# EAGLE design Pure Keys aec-pcb3-inProgress (EAGLE 8.7.0)

## Sheet 1 of 7: ATMEGA328P
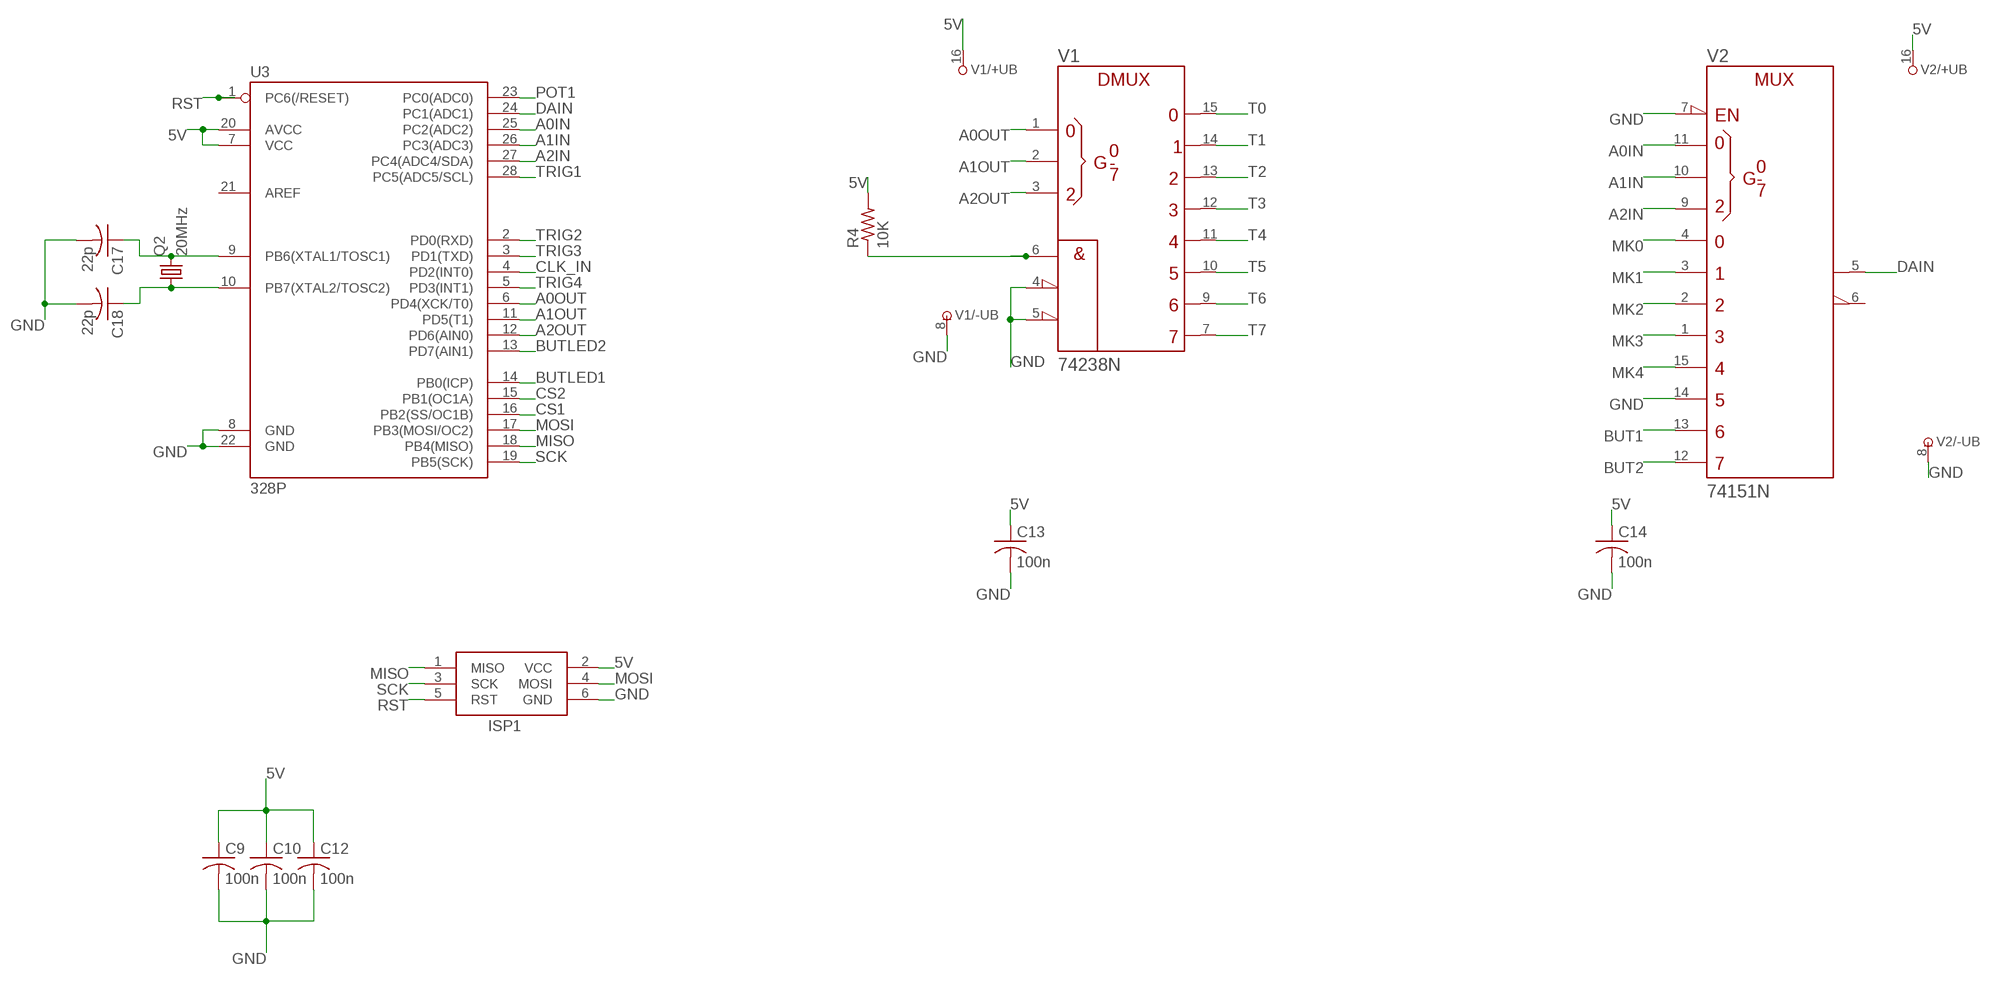
[diagram p0: schematic, sheet 1]

### Parts
C9  100n  C-USC0805K  [C0805K]
C10  100n  C-USC0805K  [C0805K]
C12  100n  C-USC0805K  [C0805K]
C13  100n  C-USC0805K  [C0805K]
C14  100n  C-USC0805K  [C0805K]
C17  22p  C-USC0805K  [C0805K]
C18  22p  C-USC0805K  [C0805K]
ISP1  AVRISP-6  [AVRISP]
Q2  20MHz  CRYSTALHC49UP  [HC49UP]
R4  10K  R-US_R0805  [R0805]
U3  328P  ATMEGA328P_PDIP  [DIP28]
V1  74238N  [DIL16]
V2  74151N  [DIL16]

### Nets
5V [Power]: C9.1 C10.1 C12.1 C13.1 C14.1 ISP1.2(VCC) R4.2 U3.7(VCC) U3.20(AVCC) V1.16(+UB) V2.16(+UB) ; also sheet 2,4,5,6,7
A0IN: U3.25(PC2(ADC2)) V2.11(A)
A0OUT: U3.6(PD4(XCK/T0)) V1.1(A)
A1IN: U3.26(PC3(ADC3)) V2.10(B)
A1OUT: U3.11(PD5(T1)) V1.2(B)
A2IN: U3.27(PC4(ADC4/SDA)) V2.9(C)
A2OUT: U3.12(PD6(AIN0)) V1.3(C)
BUT1: V2.13(D6) ; also sheet 6
BUT2: V2.12(D7) ; also sheet 6
BUTLED1: U3.14(PB0(ICP)) ; also sheet 6
BUTLED2: U3.13(PD7(AIN1)) ; also sheet 6
CLK_IN: U3.4(PD2(INT0)) ; also sheet 7
CS1: U3.16(PB2(SS/OC1B)) ; also sheet 5
CS2: U3.15(PB1(OC1A)) ; also sheet 5
DAIN: U3.24(PC1(ADC1)) V2.5(Y)
ENOUT: R4.1 V1.6(G1)
GND [Power]: C9.2 C10.2 C12.2 C13.2 C14.2 C17.2 C18.2 ISP1.6(GND) U3.8(GND) U3.22(GND) V1.4(!G2A) V1.5(!G2B) V1.8(-UB) V2.7(!G) V2.8(-UB) V2.14(D5) ; also sheet 2,3,4,5,6,7
MISO: ISP1.1(MISO) U3.18(PB4(MISO))
MK0: V2.4(D0) ; also sheet 3
MK1: V2.3(D1) ; also sheet 3
MK2: V2.2(D2) ; also sheet 3
MK3: V2.1(D3) ; also sheet 3
MK4: V2.15(D4) ; also sheet 3
MOSI: ISP1.4(MOSI) U3.17(PB3(MOSI/OC2)) ; also sheet 5
N$10: C17.1 Q2.2 U3.9(PB6(XTAL1/TOSC1))
N$11: C18.1 Q2.1 U3.10(PB7(XTAL2/TOSC2))
POT1: U3.23(PC0(ADC0)) ; also sheet 6
RST: ISP1.5(RST) U3.1(PC6(/RESET))
SCK: ISP1.3(SCK) U3.19(PB5(SCK)) ; also sheet 5
T0: V1.15(Y0) ; also sheet 3
T1: V1.14(Y1) ; also sheet 3
T2: V1.13(Y2) ; also sheet 3
T3: V1.12(Y3) ; also sheet 3
T4: V1.11(Y4) ; also sheet 3
T5: V1.10(Y5) ; also sheet 3
T6: V1.9(Y6) ; also sheet 3
T7: V1.7(Y7) ; also sheet 3
TRIG1: U3.28(PC5(ADC5/SCL)) ; also sheet 4
TRIG2: U3.2(PD0(RXD)) ; also sheet 4
TRIG3: U3.3(PD1(TXD)) ; also sheet 4
TRIG4: U3.5(PD3(INT1)) ; also sheet 4
Unconnected: U3.21(AREF) V2.6(W)

## Sheet 2 of 7: Power
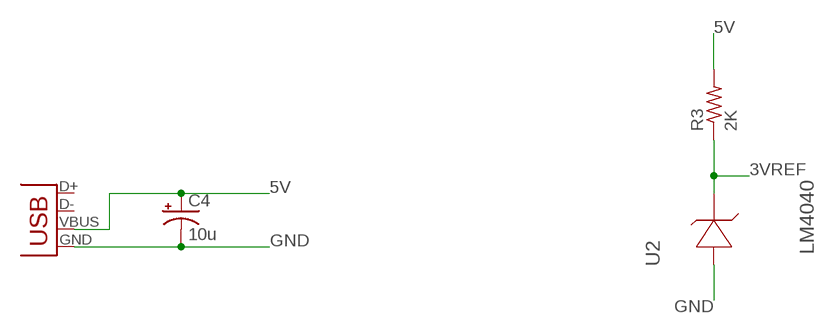
[diagram p1: schematic, sheet 2]

### Parts
C4  10u  CPOL-US153CLV-0505  [153CLV-0505]
JP2  USB-B  USBPTH  [USB-B-PTH]
R3  2K  R-US_R0805  [R0805]
U2  LM4040  LM4040A30IDBZT  [SOT95P237X112-3N]

### Nets
3VREF: R3.1 U2.1(CATHODE) ; also sheet 5
5V [Power]: C4.+ JP2.VBUS R3.2 ; also sheet 1,4,5,6,7
GND [Power]: C4.- JP2.GND U2.2(ANODE) ; also sheet 1,3,4,5,6,7
Unconnected: JP2.D+ JP2.D- U2.3(NC)

## Sheet 3 of 7: Keyboard Connector
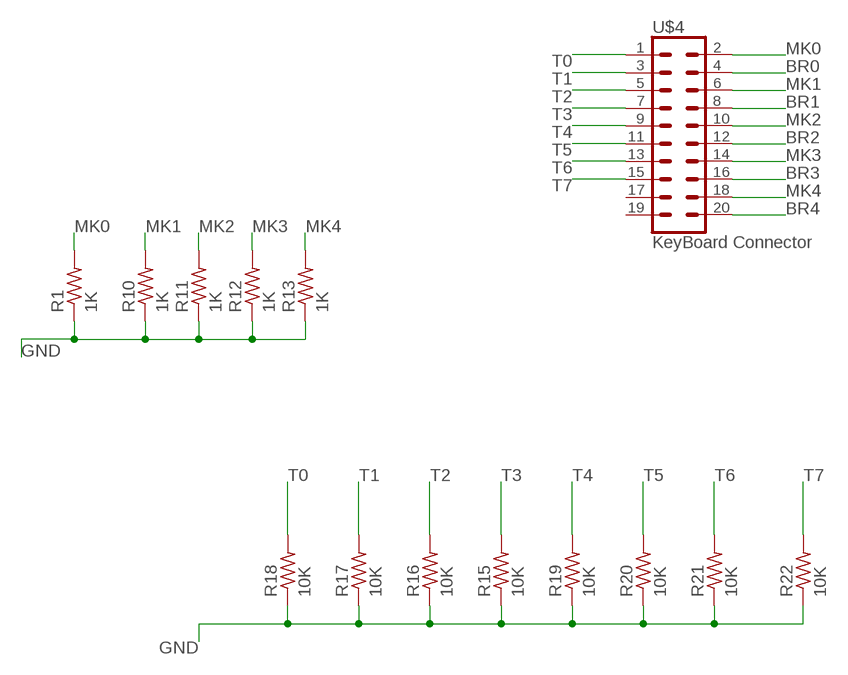
[diagram p2: schematic, sheet 3]

### Parts
R1  1K  R-US_R0805  [R0805]
R10  1K  R-US_R0805  [R0805]
R11  1K  R-US_R0805  [R0805]
R12  1K  R-US_R0805  [R0805]
R13  1K  R-US_R0805  [R0805]
R15  10K  R-US_R0805  [R0805]
R16  10K  R-US_R0805  [R0805]
R17  10K  R-US_R0805  [R0805]
R18  10K  R-US_R0805  [R0805]
R19  10K  R-US_R0805  [R0805]
R20  10K  R-US_R0805  [R0805]
R21  10K  R-US_R0805  [R0805]
R22  10K  R-US_R0805  [R0805]
U$4  KeyBoard Connector  CONN_10X2  [2X10]

### Nets
BR0: U$4.4
BR1: U$4.8
BR2: U$4.12
BR3: U$4.16
BR4: U$4.20
GND [Power]: R1.1 R10.1 R11.1 R12.1 R13.1 R15.1 R16.1 R17.1 R18.1 R19.1 R20.1 R21.1 R22.1 ; also sheet 1,2,4,5,6,7
MK0: R1.2 U$4.2 ; also sheet 1
MK1: R10.2 U$4.6 ; also sheet 1
MK2: R11.2 U$4.10 ; also sheet 1
MK3: R12.2 U$4.14 ; also sheet 1
MK4: R13.2 U$4.18 ; also sheet 1
T0: R18.2 U$4.1 ; also sheet 1
T1: R17.2 U$4.3 ; also sheet 1
T2: R16.2 U$4.5 ; also sheet 1
T3: R15.2 U$4.7 ; also sheet 1
T4: R19.2 U$4.9 ; also sheet 1
T5: R20.2 U$4.11 ; also sheet 1
T6: R21.2 U$4.13 ; also sheet 1
T7: R22.2 U$4.15 ; also sheet 1
Unconnected: U$4.17 U$4.19

## Sheet 4 of 7: Triggers
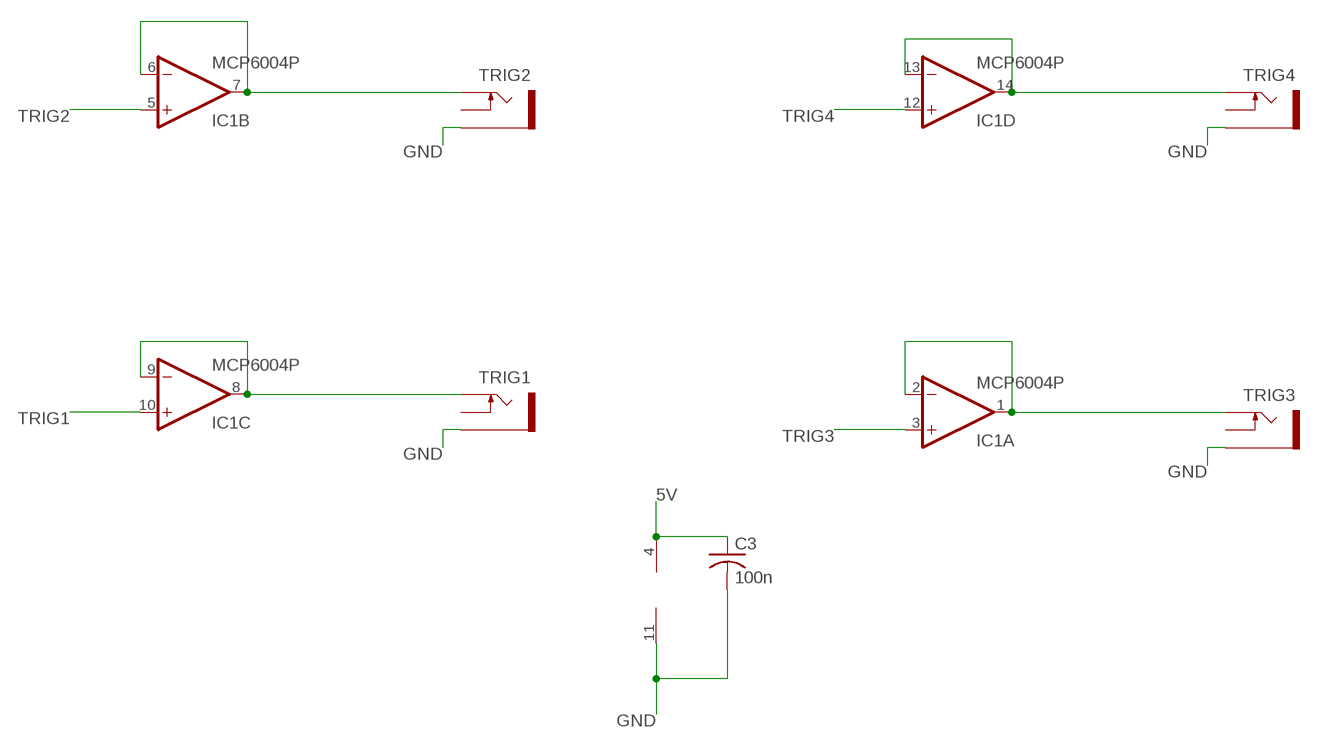
[diagram p3: schematic, sheet 4]

### Parts
C3  100n  C-USC0805K  [C0805K]
IC1  MCP6004P  [DIL14]
TRIG1  PJ302M  [PJ302M]
TRIG2  PJ302M  [PJ302M]
TRIG3  PJ302M  [PJ302M]
TRIG4  PJ302M  [PJ302M]

### Nets
5V [Power]: C3.1 IC1.4(P:V+) ; also sheet 1,2,5,6,7
GND [Power]: C3.2 IC1.11(P:V-) TRIG1.GND(SLEEVE) TRIG2.GND(SLEEVE) TRIG3.GND(SLEEVE) TRIG4.GND(SLEEVE) ; also sheet 1,2,3,5,6,7
N$3: IC1.6(B:-IN) IC1.7(B:OUT) TRIG2.TIP
N$4: IC1.8(C:OUT) IC1.9(C:-IN) TRIG1.TIP
N$5: IC1.13(D:-IN) IC1.14(D:OUT) TRIG4.TIP
N$6: IC1.1(A:OUT) IC1.2(A:-IN) TRIG3.TIP
TRIG1: IC1.10(C:+IN) ; also sheet 1
TRIG2: IC1.5(B:+IN) ; also sheet 1
TRIG3: IC1.3(A:+IN) ; also sheet 1
TRIG4: IC1.12(D:+IN) ; also sheet 1
Unconnected: TRIG1.SW(SWITCH) TRIG2.SW(SWITCH) TRIG3.SW(SWITCH) TRIG4.SW(SWITCH)

## Sheet 5 of 7: CV Out
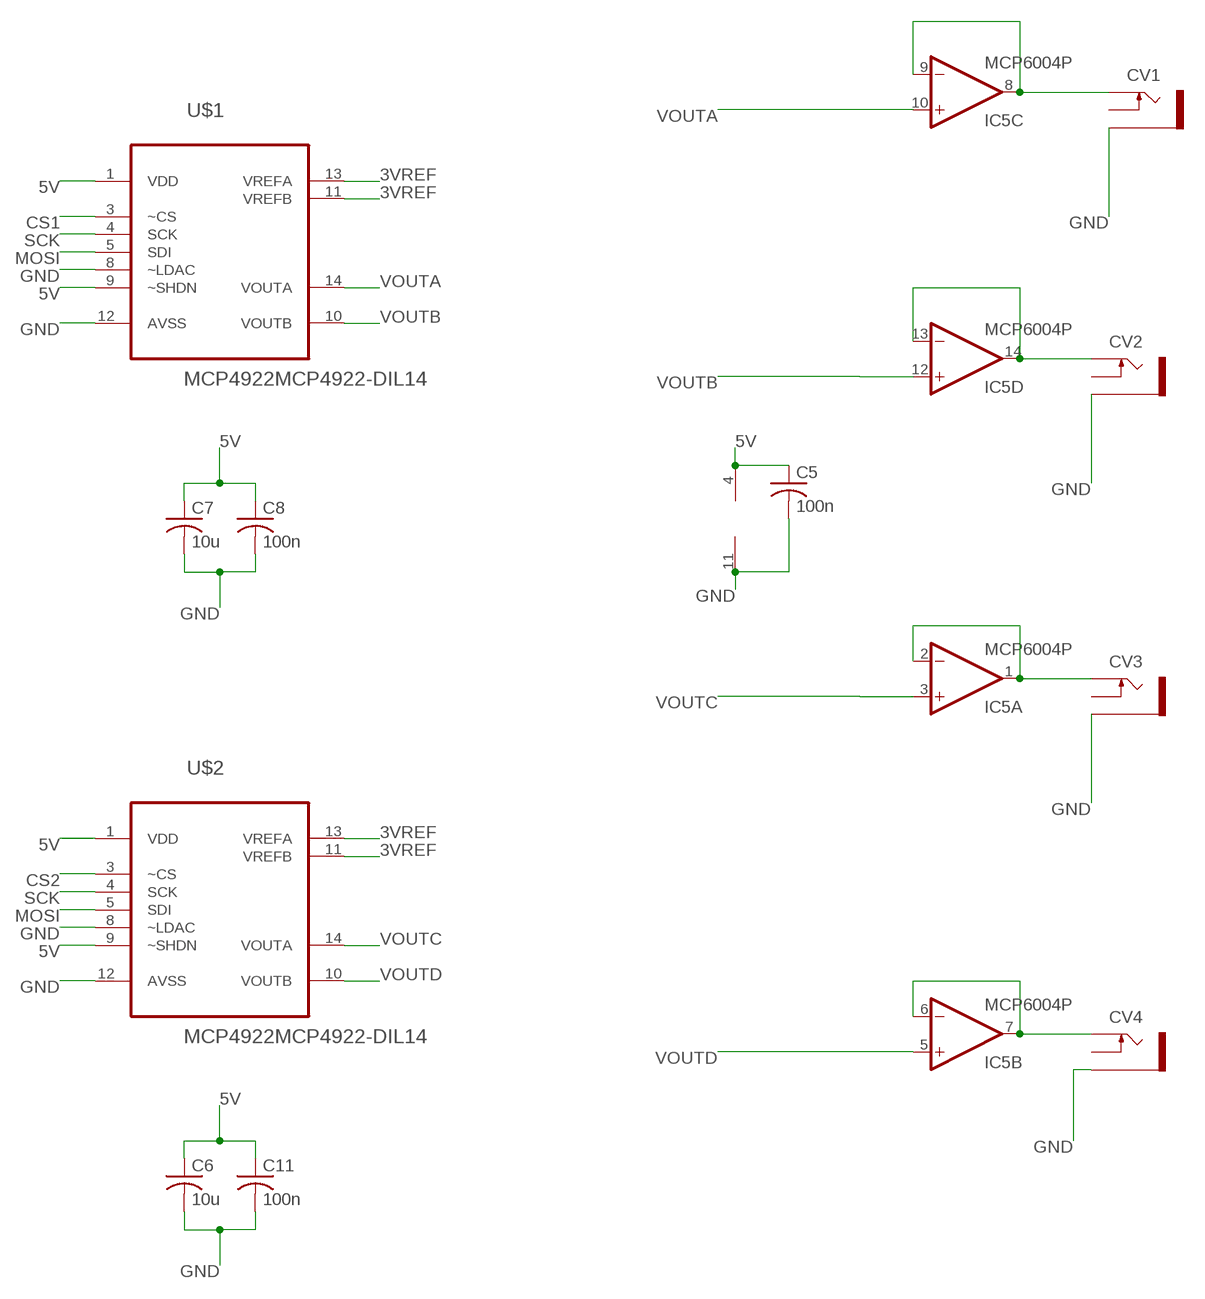
[diagram p4: schematic, sheet 5]

### Parts
C5  100n  C-USC0805K  [C0805K]
C6  10u  C-USC0805K  [C0805K]
C7  10u  C-USC0805K  [C0805K]
C8  100n  C-USC0805K  [C0805K]
C11  100n  C-USC0805K  [C0805K]
CV1  PJ302M  [PJ302M]
CV2  PJ302M  [PJ302M]
CV3  PJ302M  [PJ302M]
CV4  PJ302M  [PJ302M]
IC5  MCP6004P  [DIL14]
U$1  MCP4922MCP4922-DIL14  [DIL14]
U$2  MCP4922MCP4922-DIL14  [DIL14]

### Nets
3VREF: U$1.11(VREFB) U$1.13(VREFA) U$2.11(VREFB) U$2.13(VREFA) ; also sheet 2
5V [Power]: C5.1 C6.1 C7.1 C8.1 C11.1 IC5.4(P:V+) U$1.1(VDD) U$1.9(~SHDN) U$2.1(VDD) U$2.9(~SHDN) ; also sheet 1,2,4,6,7
CS1: U$1.3(~CS) ; also sheet 1
CS2: U$2.3(~CS) ; also sheet 1
GND [Power]: C5.2 C6.2 C7.2 C8.2 C11.2 CV1.GND(SLEEVE) CV2.GND(SLEEVE) CV3.GND(SLEEVE) CV4.GND(SLEEVE) IC5.11(P:V-) U$1.8(~LDAC) U$1.12(AVSS) U$2.8(~LDAC) U$2.12(AVSS) ; also sheet 1,2,3,4,6,7
MOSI: U$1.5(SDI) U$2.5(SDI) ; also sheet 1
N$7: CV1.TIP IC5.8(C:OUT) IC5.9(C:-IN)
N$25: CV4.TIP IC5.6(B:-IN) IC5.7(B:OUT)
N$31: CV3.TIP IC5.1(A:OUT) IC5.2(A:-IN)
N$36: CV2.TIP IC5.13(D:-IN) IC5.14(D:OUT)
SCK: U$1.4(SCK) U$2.4(SCK) ; also sheet 1
VOUTA: IC5.10(C:+IN) U$1.14(VOUTA)
VOUTB: IC5.12(D:+IN) U$1.10(VOUTB)
VOUTC: IC5.3(A:+IN) U$2.14(VOUTA)
VOUTD: IC5.5(B:+IN) U$2.10(VOUTB)
Unconnected: CV1.SW(SWITCH) CV2.SW(SWITCH) CV3.SW(SWITCH) CV4.SW(SWITCH)

## Sheet 6 of 7: Pots and Buttons
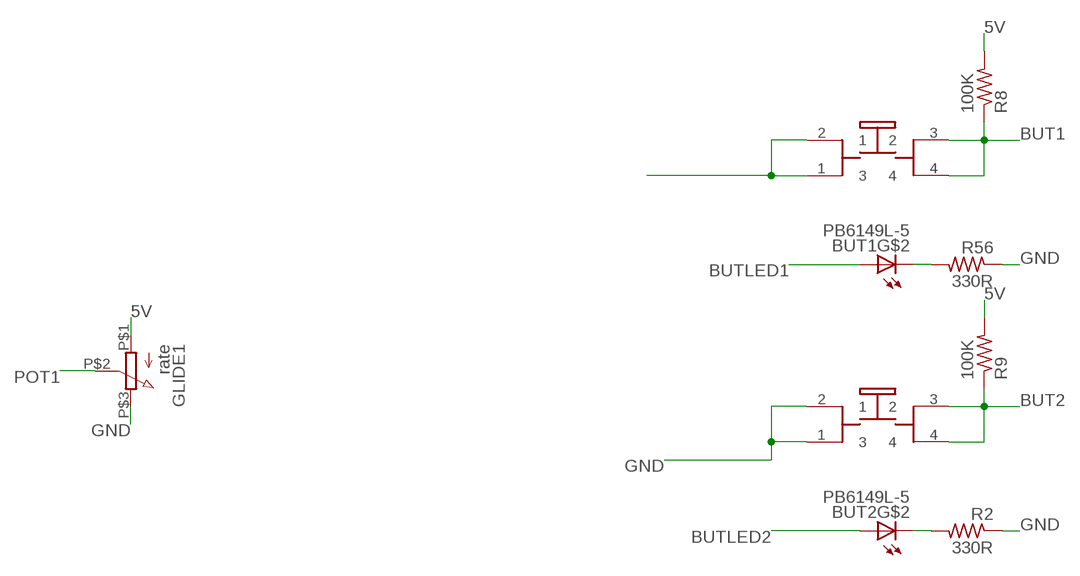
[diagram p5: schematic, sheet 6]

### Parts
BUT1  PB6149L-5  [PB6149L]
BUT2  PB6149L-5  [PB6149L]
GLIDE1  rate  9MMPOT  [POT]
R2  330R  R-US_R0805  [R0805]
R8  100K  R-US_R0805  [R0805]
R9  100K  R-US_R0805  [R0805]
R56  330R  R-US_R0805  [R0805]

### Nets
5V [Power]: GLIDE1.P$1 R8.2 R9.2 ; also sheet 1,2,4,5,7
BUT1: BUT1.3 BUT1.4 R8.1 ; also sheet 1
BUT2: BUT2.3 BUT2.4 R9.1 ; also sheet 1
BUTLED1: BUT1.A ; also sheet 1
BUTLED2: BUT2.A ; also sheet 1
GND [Power]: BUT1.1 BUT1.2 BUT2.1 BUT2.2 GLIDE1.P$3 R2.1 R56.1 ; also sheet 1,2,3,4,5,7
N$8: BUT2.K(C) R2.2
N$65: BUT1.K(C) R56.2
POT1: GLIDE1.P$2 ; also sheet 1

## Sheet 7 of 7: Clock
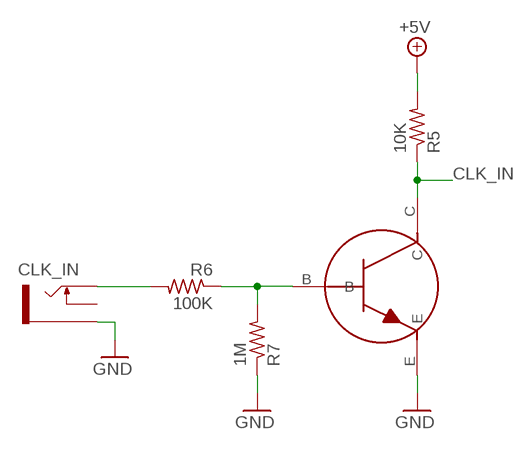
[diagram p6: schematic, sheet 7]

### Parts
CLK_IN  PJ302M  [PJ302M]
R5  10K  R-US_R0805  [R0805]
R6  100K  R-US_R0805  [R0805]
R7  1M  R-US_R0805  [R0805]
T1  2N3904  TRANSISTOR_MMBT3904  [TRANSISTOR_SINGLE_N-TYPE]

### Nets
5V [Power]: R5.2 ; supply symbol labelled +5V ; also sheet 1,2,4,5,6
CLK_IN: R5.1 T1.C ; also sheet 1
GND [Power]: CLK_IN.GND(SLEEVE) R7.1 T1.E ; also sheet 1,2,3,4,5,6
N$17: R6.1 R7.2 T1.B
N$26: CLK_IN.TIP R6.2
Unconnected: CLK_IN.SW(SWITCH)

## Library data of the parts
BUT1 BUT2 = INSTRUO:PB6149L-5
C3 C5-C14 C17 C18 = rcl:C-US: CAPACITOR, American symbol
C4 = rcl:CPOL-US: POLARIZED CAPACITOR, American symbol
CLK_IN CV1-CV4 TRIG1-TRIG4 = GMSN:PJ302M: PJ302M horizontal / right angled mount 3.5 mm jack socket
GLIDE1 = GMSN:9MMPOT
IC1 IC5 = GMSN-R2Project:MCP6004: OP AMP
ISP1 = adafruit:AVRISP: AVR ISP HEADER Standard 6 pin header for AVR programming
JP2 = SparkFun-Connectors:USB: USB Connectors USB-B-PTH is fully proven SKU : PRT-00139/CONN-08278 USB-miniB is fully proven SKU : PRT-00587 USB-A-PCB is untested. USB-A-H is throughly reviewed, but untested. Spark Fun Electronics SKU : PRT-00437 USB-B-SMT is throughly reviewed, but untested. Needs silkscreen touching up. USB-A-S has not been used/tested USB-MB-H has not been used/tested USB-MICROB has been used. CONN-09505; PROD_ID: CONN-08278
Q2 = adafruit:CRYSTAL: CRYSTAL; OC_FARNELL: unknown; OC_NEWARK: unknown
R1 R10-R13 = rcl:R-US_: RESISTOR, American symbol; RS-PART: 223-0427
R2-R9 R15-R22 R56 = rcl:R-US_: RESISTOR, American symbol
T1 = INSTRUO:TRANSISTOR_MMBT3904
U2 = GMSN-R2Project:LM4040A30IDBZT: PRECISION MICROPOWER SHUNT VOLTAGE REFERENCE; MPN: LM4040A30IDBZT; OC_FARNELL: 1755108; OC_NEWARK: 58K5870; PACKAGE: 3-SOT-23; RS-PART: 809-6343; SUPPLIER: TEXAS INSTRUMENTS
U3 = SparkFun-IC-Microcontroller:ATMEGA328P_PDIP: Atmel 328P Through hole ATMEGA328P uC used in the Arduino 32kb flash, 1k EEPROM, 2k SRAM Datasheet <http://www.sparkfun.com/datasheets/Components/SMD/ATMega328.pdf> SparkFun Products Storefront component: AVR 28 Pin 20MHz 32K 6A/D - ATMega328P <https://www.sparkfun.com/products/9061> (COM-09061) SparkFun Simon Says - Through-Hole Soldering Kit <https://www.sparkfun.com/products/10547> (KIT-10547) SparkFun Learn to Solder - Simon Says <https://www.sparkfun.com/products/13708> (KIT-13708) SparkFun BigTime Watch Kit <https://www.sparkfun.com/products/11734> (KIT-11734) SparkFun ClockIt <https://www.sparkfun.com/products/10930> (KIT-10930) SparkFun Serial Enabled LCD Kit <https://www.sparkfun.com/products/10097> (LCD-10097) SparkFun Simon Tilts - Through Hole Soldering Kit <https://www.sparkfun.com/products/12634> (KIT-12634) SparkFun Frequency Counter Kit <https://www.sparkfun.com/products/10140> (KIT-10140) FabFM Radio Kit <https://www.sparkfun.com/products/11043> (KIT-11043) SparkFun Binary Blaster Kit <https://www.sparkfun.com/products/12037> (KIT-12037) SparkFun Metro-Gnome <https://www.sparkfun.com/products/9236> (KIT-09236) ATmega328 with Arduino Optiboot (Uno) <https://www.sparkfun.com/products/10524> (DEV-10524); PROD_ID: IC-09136
U$1 U$2 = GMSN-R2Project:MCP4922
U$4 = SparkFun-Connectors:CONN_10X2: Multi connection point. Often used as Generic Header-pin footprint for 0.1 inch spaced/style header connections On any of the 0.1 inch spaced packages, you can populate with these: Break Away Headers - Straight <https://www.sparkfun.com/products/116> (PRT-00116) Break Away Male Headers - Right Angle <https://www.sparkfun.com/products/553> (PRT-00553) Female Headers <https://www.sparkfun.com/products/115> (PRT-00115) Break Away Headers - Machine Pin <https://www.sparkfun.com/products/117> (PRT-00117) Break Away Female Headers - Swiss Machine Pin <https://www.sparkfun.com/products/743> (PRT-00743); RS-PART: 669-5364
V1 = 74ttl-din:74*238: 1 of 8 noninverting DECODER/DEMULTIPLEXER
V2 = 74ttl-din:74*151: Data SELECTOR/MULTIPLEXER

## Net classes
1 Power: width 0.8 mm

## Board
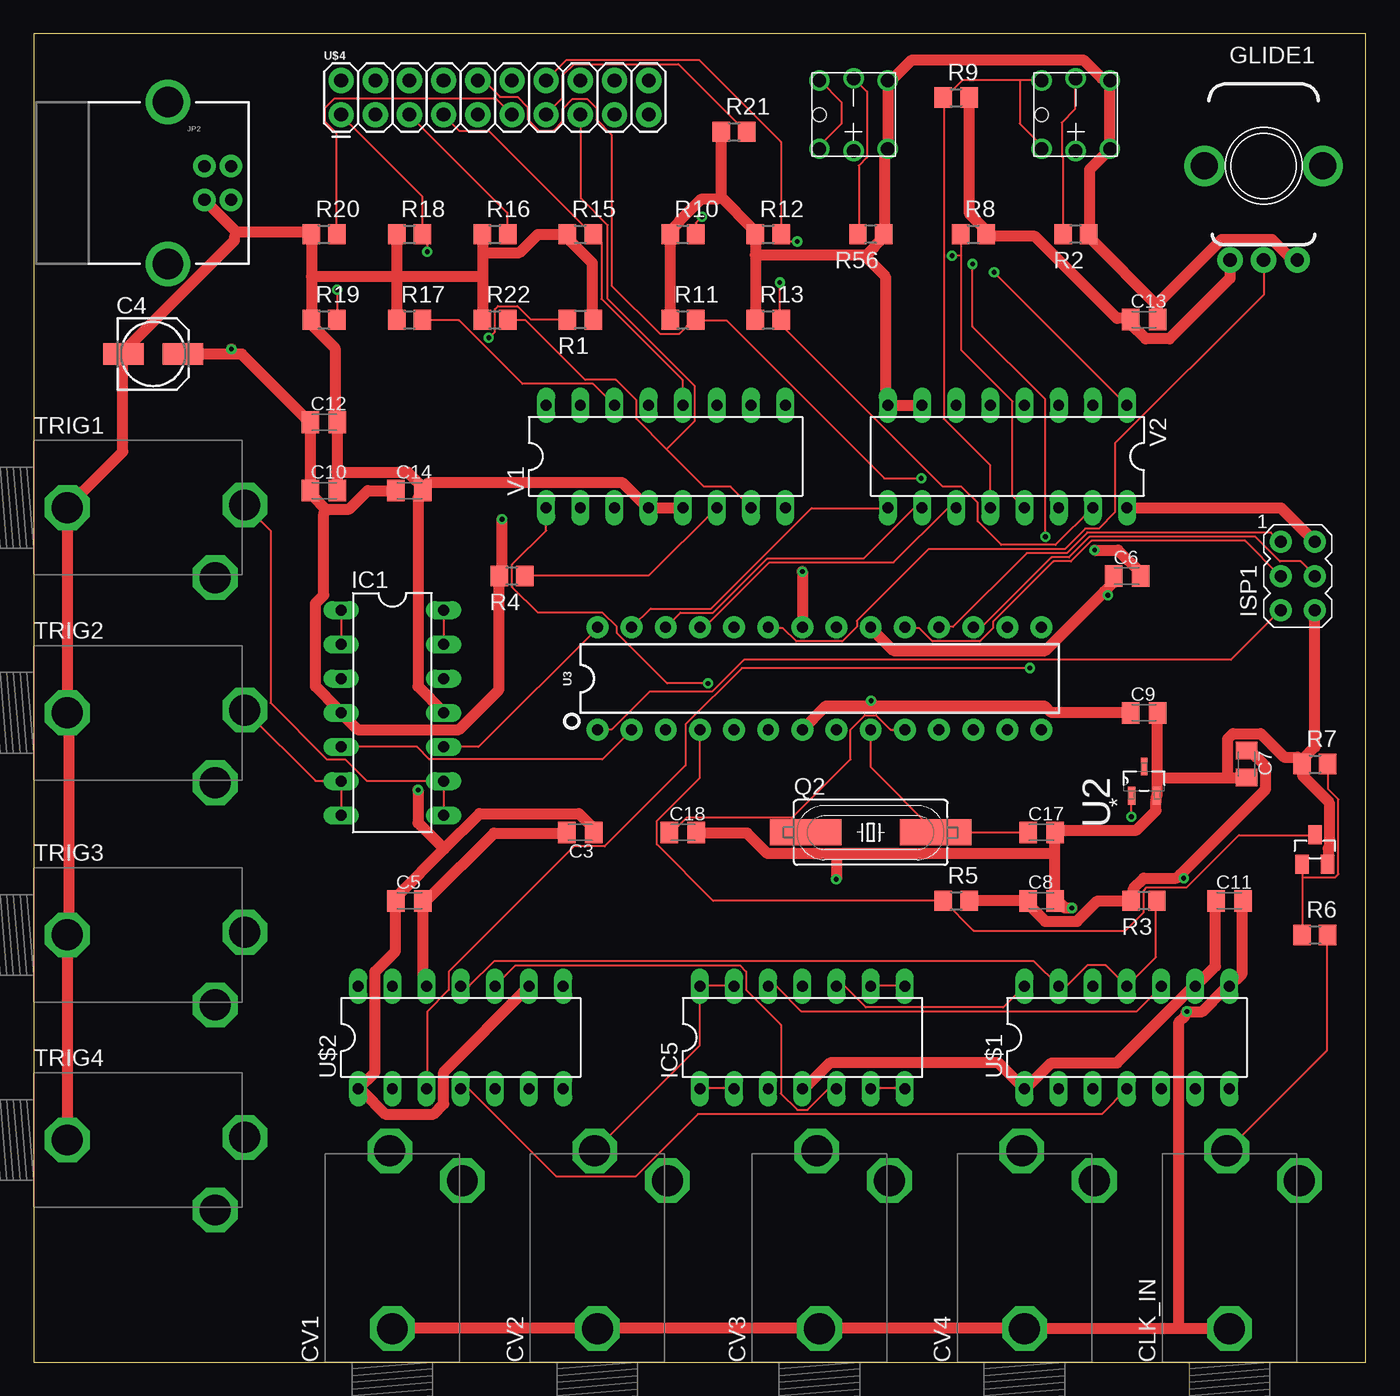
[diagram p7: board, top side]
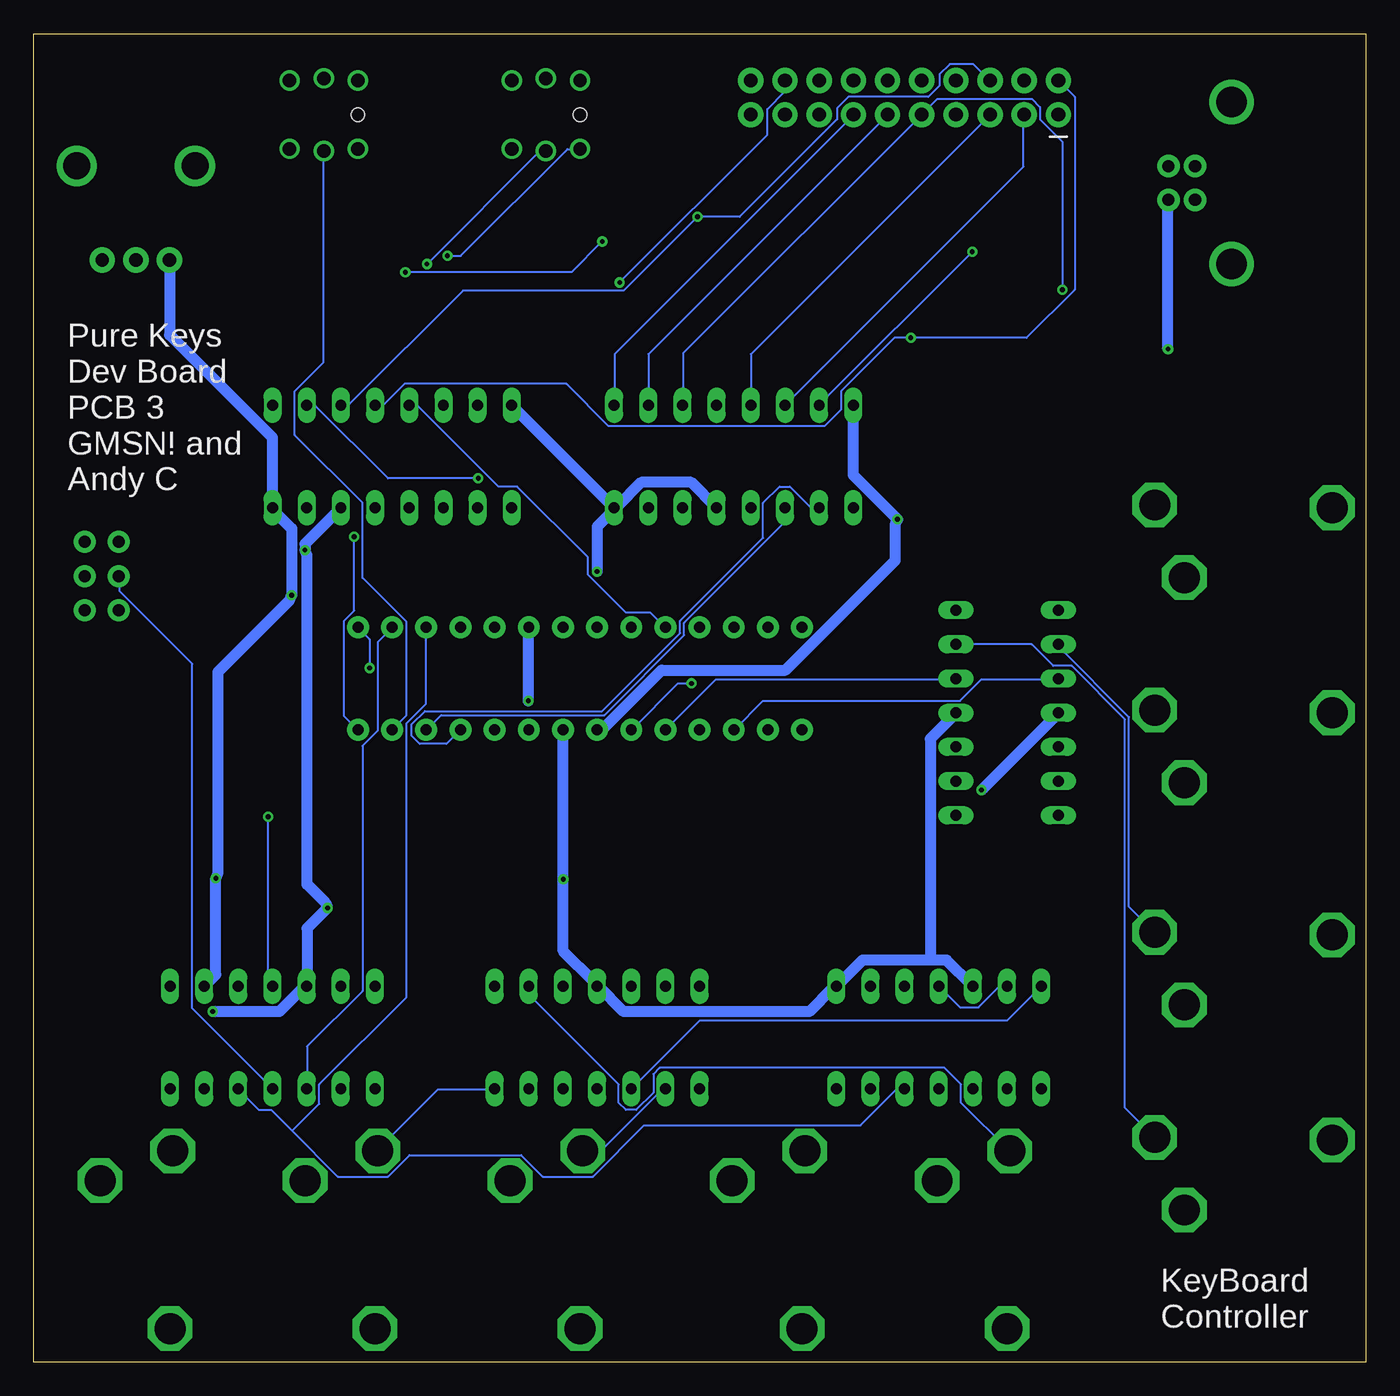
[diagram p8: board, bottom side, seen from below]

Size 99.04 x 98.73 mm. Coordinates in mm from the lower left corner, seen from the top.
Outline: 0,0 99.04,0 99.04,98.73 0,98.73 0,0
Copper layers (1*16): Top 0.035mm / dielectric 1.5mm / Bottom 0.035mm
Design rules "default": minimum track width 6mil, minimum drill 0.35mm, track to track 6mil, track to pad 6mil, pad to pad 6mil, via to via 6mil, smd to smd 6mil, copper to edge 40mil, drill to drill 6mil, minimum pad ring 10mil, minimum via ring 8mil, stop-mask expansion 4mil, vias tented up to drill 0mil, thermal gap 10mil

### Footprints (pad centres in the part's own frame; a part is rotated, then mirrored left to right if it is on the bottom)
PB6149L = drill 1: 1 2.54,-2.54; 2 2.54,2.54; 3 -2.54,-2.54; 4 -2.54,2.54; A 0,-2.7; K 0,2.7 | hole 1: -2.54,0
C0805K = smd 1.3 x 1.6: 1 -1,0; 2 1,0
153CLV-0505 = smd 3 x 1.6: + 2.2,0; - -2.2,0
PJ302M = drill 2.3 pad 3.3 octagon: GND 2.5,0; SW 13.5,-5.2; TIP 15.7,0.2
POT = drill 1 pad 1.88: P$1 -2.5,-7; P$2 0,-7; P$3 2.5,-7 | drill 2 pad 2.68: P$4 -4.4,0; P$5 4.4,0
DIL14 = drill 0.813 long: 1 -7.62,-3.81; 2 -5.08,-3.81; 3 -2.54,-3.81; 4 0,-3.81; 5 2.54,-3.81; 6 5.08,-3.81; 7 7.62,-3.81; 8 7.62,3.81; 9 5.08,3.81; 10 2.54,3.81; 11 0,3.81; 12 -2.54,3.81; 13 -5.08,3.81; 14 -7.62,3.81
AVRISP = drill 0.9 pad 1.626: 1 -1.27,2.54; 2 1.27,2.54; 3 -1.27,0; 4 1.27,0; 5 -1.27,-2.54; 6 1.27,-2.54
USB-B-PTH = drill 0.914 pad 1.676: D+ 0,1.25; D- 1.981,1.25; GND 0,-1.25; VBUS 1.981,-1.25 | drill 2.286: S1 -2.718,-6.02; S2 -2.718,6.02
HC49UP = smd 5.334 x 1.93: 1 -4.826,0; 2 4.826,0
R0805 = smd 1.3 x 1.5: 1 -0.95,0; 2 0.95,0
TRANSISTOR_SINGLE_N-TYPE = smd 1 x 1.4: B -0.95,-1.1; C 0,1.1; E 0.95,-1.1
SOT95P237X112-3N = smd 1.321 x 0.559: 1 -1.092,0.94; 2 -1.092,-0.94 | smd 1.321 x 0.508: 3 1.092,0
DIP28 = drill 0.813 pad 1.626: 1 -16.51,-3.81; 2 -13.97,-3.81; 3 -11.43,-3.81; 4 -8.89,-3.81; 5 -6.35,-3.81; 6 -3.81,-3.81; 7 -1.27,-3.81; 8 1.27,-3.81; 9 3.81,-3.81; 10 6.35,-3.81; 11 8.89,-3.81; 12 11.43,-3.81; 13 13.97,-3.81; 14 16.51,-3.81; 15 16.51,3.81; 16 13.97,3.81; 17 11.43,3.81; 18 8.89,3.81; 19 6.35,3.81; 20 3.81,3.81; 21 1.27,3.81; 22 -1.27,3.81; 23 -3.81,3.81; 24 -6.35,3.81; 25 -8.89,3.81; 26 -11.43,3.81; 27 -13.97,3.81; 28 -16.51,3.81
2X10 = drill 1.016 pad 1.88: 1 0,0; 2 0,2.54; 3 2.54,0; 4 2.54,2.54; 5 5.08,0; 6 5.08,2.54; 7 7.62,0; 8 7.62,2.54; 9 10.16,0; 10 10.16,2.54; 11 12.7,0; 12 12.7,2.54; 13 15.24,0; 14 15.24,2.54; 15 17.78,0; 16 17.78,2.54; 17 20.32,0; 18 20.32,2.54; 19 22.86,0; 20 22.86,2.54
DIL16 = drill 0.813 long: 1 -8.89,-3.81; 2 -6.35,-3.81; 3 -3.81,-3.81; 4 -1.27,-3.81; 5 1.27,-3.81; 6 3.81,-3.81; 7 6.35,-3.81; 8 8.89,-3.81; 9 8.89,3.81; 10 6.35,3.81; 11 3.81,3.81; 12 1.27,3.81; 13 -1.27,3.81; 14 -3.81,3.81; 15 -6.35,3.81; 16 -8.89,3.81

### Placement (x,y rotation side)
BUT1  60.96,92.71 0 top
BUT2  77.47,92.71 0 top
C3  40.64,39.37 180 top
C4  8.89,74.93 0 top
C5  27.94,34.29 0 top
C6  81.28,58.42 0 top
C7  90.17,44.45 270 top
C8  74.93,34.29 0 top
C9  82.55,48.26 0 top
C10  21.59,64.77 0 top
C11  88.9,34.29 0 top
C12  21.59,69.85 0 top
C13  82.55,77.47 0 top
C14  27.94,64.77 0 top
C17  74.93,39.37 0 top
C18  48.26,39.37 0 top
CLK_IN  88.9,0 90 top
CV1  26.67,0 90 top
CV2  41.91,0 90 top
CV3  58.42,0 90 top
CV4  73.66,0 90 top
GLIDE1  91.44,88.9 0 top
IC1  26.67,48.26 270 top
IC5  57.15,24.13 0 top
ISP1  93.98,58.42 0 top
JP2  12.7,87.63 0 top
Q2  62.23,39.37 0 top
R1  40.64,77.47 180 top
R2  77.47,83.82 180 top
R3  82.55,34.29 180 top
R4  35.56,58.42 180 top
R5  68.58,34.29 0 top
R6  95.25,31.75 0 top
R7  95.25,44.45 0 top
R8  69.85,83.82 0 top
R9  68.58,93.98 0 top
R10  48.26,83.82 0 top
R11  48.26,77.47 0 top
R12  54.61,83.82 0 top
R13  54.61,77.47 0 top
R15  40.64,83.82 0 top
R16  34.29,83.82 0 top
R17  27.94,77.47 0 top
R18  27.94,83.82 0 top
R19  21.59,77.47 0 top
R20  21.59,83.82 0 top
R21  52.07,91.44 0 top
R22  34.29,77.47 0 top
R56  62.23,83.82 180 top
T1  95.25,38.1 0 top
TRIG1  0,63.5 0 top
TRIG2  0,48.26 0 top
TRIG3  0,31.75 0 top
TRIG4  0,16.51 0 top
U2  82.55,43.18 90 top
U3  58.42,50.8 0 top
U$1  81.28,24.13 0 top
U$2  31.75,24.13 0 top
U$4  22.86,92.71 0 top
V1  46.99,67.31 0 top
V2  72.39,67.31 180 top

### Tracks (layer width: path | path; a pad name or v marks a point on that pad's centre or on a via)
3VREF  (via drill 0.35)
  Top 0.152: v81.61,40.54 U2.1 | R3.1 83.44,34.29 83.44,30.1 U$1.11 81.23,27.96 79.7,29.49 78.33,29.49 76.81,27.96 76.2,27.96 | 76.2,27.96 74.37,29.79 34.21,29.79 32.38,27.96 31.77,27.96 U$2.11 | 76.2,27.96 U$1.13
  Bottom 0.152: U$2.11 30.18,26.36 28.8,26.36 27.28,27.89 26.67,27.89 U$2.13 | v81.61,40.54 81.61,28.27 U$1.11
5V  (via drill 0.35)
  Top 0.8: C14.1 24.84,64.77 23.47,63.4 21.72,63.4 | 21.72,63.4 20.73,64.39 C10.1 20.57,64.77 20.57,69.8 C12.1 20.27,70.1 15.47,74.91 14.71,74.91 | 14.71,74.91 11.12,74.91 C4.+ | v14.71,75.29 14.71,74.91 | 30.52,38.14 27.05,34.67 C5.1 26.9,34.29 26.9,30.56 25.38,29.03 25.38,21.57 U$2.1 24.46,20.12 26.14,18.44 29.72,18.44 30.48,19.2 30.48,21.57 36.8,27.89 U$2.9 | 30.52,38.14 33.15,40.77 40.54,40.77 41.6,39.7 41.6,39.4 C3.1 | v34.82,62.64 34.82,58.75 R4.2 34.59,58.37 34.59,49.99 31.62,47.02 24.08,47.02 22.86,48.23 IC1.4 22.63,48.54 20.95,50.22 20.95,56.39 21.57,57 21.57,63.02 21.72,63.4 | 30.52,38.14 28.57,40.08 v28.57,42.52 | R5.2 C8.1 74.07,33.91 75.21,32.77 77.57,32.77 79.1,34.29 R3.2 81.76,34.67 81.76,35.2 82.53,35.97 84.96,35.97 85.23,36.23 | 85.23,36.23 91.59,42.6 91.59,44.27 90.45,45.41 90.22,45.41 C7.1 | C11.1 87.86,34.29 87.86,29.41 86.41,27.96 U$1.9 86.03,27.74 80.54,22.25 75.67,22.25 73.99,20.57 U$1.1 73.61,20.34 71.7,22.25 59.21,22.25 57.3,20.34 57.15,20.34 IC5.4 | v85.5,35.97 85.23,36.23 | 79.59,57.26 75.21,52.88 63.93,52.88 62.26,54.56 U3.20 | 79.59,57.26 80.24,57.91 80.24,58.37 C6.1 | 62.26,48.77 58.9,48.77 57.15,47.02 U3.7 | 62.26,48.77 75.13,48.77 75.59,48.31 81.53,48.31 C9.1 | v62.26,49.15 62.26,48.77 | ISP1.2 92.73,63.48 81.31,63.48 V2.16 | R9.2 69.57,93.95 69.57,85.34 70.79,84.12 R8.2 71.17,83.67 74.45,83.67 80.54,77.57 81.15,77.57 C13.1 81.61,77.42 81.61,77.11 82.68,76.05 84.43,76.05 88.92,80.54 88.92,81.84 GLIDE1.P$1 | v79.86,57 79.59,57.26
  Bottom 0.8: v14.71,75.29 14.71,86.33 JP2.VBUS | V1.16 38.1,65.91 v34.82,62.64 34.98,62.26 34.98,59.59 43.13,51.44 52.35,51.44 56.77,47.02 57.15,47.02 U3.7 | v28.57,42.52 22.86,48.23 IC1.4 | U$1.9 85.5,28.8 v85.5,35.97 85.34,36.35 85.34,51.28 80.01,56.62 v79.86,57 79.86,61.95 81.08,63.17 V2.16 81.31,63.55 81.31,68.73 88.92,76.35 88.92,81.84 GLIDE1.P$1 | v62.26,49.15 62.26,54.56 U3.20
A0IN
  Top 0.152: V2.11 68.58,63.48 67.97,63.48 63.93,59.44 54.71,59.44 49.91,54.63 49.53,54.63 U3.25
A0OUT  (via drill 0.35)
  Top 0.152: V1.1 38.1,61.8 35.59,59.28 35.59,57.61 37.49,55.7 42.29,55.7 43.36,54.63 43.36,54.18 47.09,50.44 v50.14,50.44
  Bottom 0.152: v50.14,50.44 51.13,50.44 54.56,47.02 U3.6
A1IN
  Top 0.152: U3.26 48.08,55.7 50.52,55.7 54.56,59.74 61.72,59.74 65.46,63.48 65.99,63.48 V2.10
A1OUT
  Bottom 0.152: U3.11 68.35,45.95 70.33,45.95 70.94,46.56 70.94,47.4 69.95,48.39 56.77,48.39 50.98,54.18 50.98,55.09 44.81,61.27 44.81,63.86 43.59,65.08 42.82,65.08 41.3,63.55 40.69,63.55 V1.2
A2IN
  Top 0.152: V2.9 63.48,63.48 57.84,63.48 50.37,56.01 45.87,56.01 44.5,54.63 U3.27
A2OUT
  Bottom 0.152: V1.3 43.2,63.48 43.2,62.41 50.67,54.94 50.67,54.03 56.62,48.08 68.73,48.08 69.8,47.02 U3.12
BUT1  (via drill 0.35)
  Top 0.152: BUT1.3 58.45,90.22 58.45,90.45 60.05,92.05 60.05,93.65 58.45,95.25 BUT1.4 | 68.96,82.22 68.96,75.21 72.77,71.4 72.77,64.39 V2.13 | 68.96,82.22 68.96,83.82 R8.1 | 68.96,82.22 v68.28,82.22
  Bottom 0.152: v68.28,82.22 67.28,82.22 59.36,90.14 58.45,90.14 BUT1.3
BUT2
  Top 0.152: BUT2.4 73.3,95.25 | 73.3,95.25 69.04,95.25 67.82,94.03 67.67,94.03 R9.1 67.67,93.95 67.67,70.1 71.09,66.67 71.09,63.55 V2.12 | 73.3,95.25 73.3,92.05 74.91,90.45 74.91,90.22 BUT2.3
BUTLED1  (via drill 0.35)
  Top 0.152: v69.8,81.61 69.8,76.96 75.21,71.55 v75.21,61.34
  Bottom 0.152: v69.8,81.61 61.42,89.99 60.96,89.99 BUT1.A | v75.21,61.34 75.21,55.85 75.97,55.09 75.97,48.01 74.98,47.02 U3.14
BUTLED2
  Bottom 0.152: BUT2.A 77.5,89.99 77.5,74.3 79.63,72.16 79.63,68.89 74.6,63.86 74.6,58.29 71.32,55.02 71.32,48.08 72.39,47.02 U3.13
CLK_IN
  Top 0.152: T1.C 95.25,39.17 89.61,39.17 85.72,35.28 82.75,35.28 82.53,35.05 82.53,33.45 81.15,32.08 69.88,32.08 67.67,34.29 R5.1 50.52,34.29 46.33,38.48 46.33,40.23 49.53,43.43 U3.4
CS1
  Bottom 0.152: U$1.3 78.72,20.34 78.72,23.47 74.6,27.58 74.6,45.8 73.46,46.94 73.46,53.49 72.39,54.56 U3.16
CS2  (via drill 0.35)
  Top 0.152: v74.07,51.59 52.65,51.59 48.46,47.4 48.46,44.35 42.44,38.33 40.16,38.33 30.86,29.03 30.86,27.66 29.26,26.06 29.26,20.34 U$2.3
  Bottom 0.152: v74.07,51.59 74.07,53.72 74.91,54.56 U3.15
DAIN
  Bottom 0.152: V2.5 71.09,71.09 70.48,71.09 64.47,65.08 63.09,65.08 57.84,59.82 57.84,58.52 55.02,55.7 53.19,55.7 52.12,54.63 U3.24
ENOUT
  Top 0.152: R4.1 36.58,58.45 45.72,58.45 50.75,63.48 V1.6
GND  (via drill 0.35)
  Top 0.8: CV1.GND 26.67,2.52 41.91,2.52 CV2.GND 42.29,2.52 58.06,2.52 CV3.GND 58.45,2.52 73.61,2.52 CV4.GND 74.07,2.52 85.11,2.52 | 85.11,2.52 88.85,2.52 CLK_IN.GND | U$2.12 28.96,28.19 28.96,34.29 C5.2 29.34,34.44 34.21,39.32 39.62,39.32 C3.2 | T1.E 96.24,37.03 96.24,38.18 96.32,38.25 96.32,41.6 94.34,43.59 94.34,44.42 R7.1 | ISP1.6 95.25,45.72 94.34,44.81 R7.1 | v78.87,60.35 80.62,60.35 82.22,58.75 82.22,58.45 C6.2 | 83.52,43.43 83.52,48.23 C9.2 | 83.52,43.43 83.52,42.14 U2.2 83.44,41.68 83.44,41 81.99,39.55 76.28,39.55 C17.2 75.89,39.32 75.89,37.8 | 83.52,43.43 88.77,43.43 | 88.77,43.43 90.14,43.43 C7.2 | C11.2 89.84,34.29 89.84,28.88 U$1.8 88.54,27.74 86.87,26.06 v85.72,26.06 85.57,25.68 85.11,25.22 85.11,2.52 | 75.89,37.8 75.89,34.29 C8.2 76.28,34.14 76.66,33.76 v77.19,33.76 | 75.89,37.8 59.66,37.8 | 59.66,37.8 54.56,37.8 53.03,39.32 49.3,39.32 C18.2 | 88.77,43.43 88.77,46.33 89.15,46.71 91.21,46.71 92.96,44.96 93.95,44.96 R7.1 | 59.66,37.8 v59.66,35.89 | V2.7 65.99,71.09 63.55,71.09 V2.8 63.32,71.48 63.32,80.7 62.1,81.92 61.95,82.3 | V1.5 48.23,63.48 45.72,63.48 V1.4 45.41,63.7 43.74,65.38 29.41,65.38 29.26,65.23 C14.2 | v57.15,58.75 U3.22 | 83.52,78.56 83.52,77.5 C13.2 | 83.52,78.56 78.64,83.44 R2.1 78.49,83.82 78.49,88.62 80.01,90.14 BUT2.1 BUT2.2 79.63,95.4 79.4,95.4 78.03,96.77 65.3,96.77 63.93,95.4 BUT1.2 63.55,95.25 63.55,90.53 BUT1.1 63.25,89.92 63.25,83.82 R56.1 63.02,83.44 62.48,82.91 62.48,82.83 61.95,82.3 | GLIDE1.P$3 93.88,81.92 93.57,81.92 92.05,83.44 88.32,83.44 83.74,78.87 83.52,78.56 | R11.1 47.32,77.5 R10.1 47.47,84.2 48.01,84.73 48.01,84.81 49.61,86.41 50.75,86.41 51.13,86.56
  Top 0.8: 53.65,82.3 53.65,83.82 R12.1 53.49,84.2 51.13,86.56 | 53.65,82.3 53.65,77.5 R13.1 | 51.13,86.56 R21.1 | 53.65,82.3 61.95,82.3 | 22.55,66.14 22.55,69.8 C12.2 22.4,70.18 22.4,75.36 20.65,77.11 R19.1 20.65,77.5 20.65,80.7 | 22.55,66.14 22.55,64.77 C10.2 | 22.55,66.14 27.81,66.14 28.88,65.08 28.88,64.77 C14.2 | IC1.11 30.48,48.31 28.57,50.22 28.57,64.24 28.73,64.39 C14.2 | 33.38,82.45 33.38,83.82 R16.1 | 33.38,82.45 33.38,80.7 | 33.38,80.7 33.38,77.5 R22.1 | 33.38,82.45 36.12,82.45 37.49,83.82 R15.1 39.78,83.44 41.53,81.69 41.53,77.5 R1.1 | 26.98,80.7 26.98,83.82 R18.1 | 26.98,80.7 26.98,77.5 R17.1 | 20.65,80.7 R20.1 20.27,83.97 15.09,83.97 | 15.09,83.97 12.72,86.33 JP2.GND | 20.65,80.7 26.98,80.7 | 26.98,80.7 33.38,80.7 | TRIG4.GND 2.52,16.54 2.52,31.7 TRIG3.GND 2.59,32.16 2.59,47.85 TRIG2.GND 2.52,48.31 2.52,63.09 TRIG1.GND 2.52,63.55 6.63,67.67 6.63,74.91 C4.- 6.86,75.29 14.94,83.36 14.94,83.59 15.09,83.97
  Bottom 0.8: 32.38,29.87 31.17,29.87 29.26,27.96 U$2.12 | 32.38,29.87 37.41,29.87 39.32,27.96 U$2.8 39.7,27.74 41.38,26.06 55.17,26.06 57,27.89 57.15,27.89 IC5.11 57.38,28.27 59.66,30.56 v59.66,35.89 59.66,46.94 U3.8 | V2.14 76.2,63.48 78.87,60.81 v78.87,60.35 78.72,59.97 78.72,35.51 77.34,34.14 v77.19,33.76 78.72,32.23 78.72,27.96 U$1.12 79.1,27.74 80.77,26.06 v85.72,26.06 | V1.5 50.14,65.38 53.87,65.38 55.7,63.55 55.85,63.55 V1.8 | v57.15,58.75 57.15,62.1 56.08,63.17 V1.8 | V1.8 V2.8 | 32.38,29.87 32.38,46.33 30.48,48.23 IC1.11
MISO
  Top 0.152: U3.18 67.36,54.63 68.35,54.63 73.84,60.12 76.81,60.12 78.33,61.65 91.97,61.65 92.66,60.96 ISP1.1
MK0  (via drill 0.35)
  Top 0.152: v33.83,76.12 34.29,76.58 34.29,78.26 34.52,78.49 35.97,78.49 36.96,77.5 39.62,77.5 R1.2
  Bottom 0.152: U$4.2 21.64,94.03 21.64,79.7 25.22,76.12 v33.83,76.12 35.05,76.12 39.01,72.16 39.01,70.79 40.23,69.57 56.31,69.57 59.44,72.69 71.48,72.69 73,71.17 73.61,71.17 V2.4
MK1  (via drill 0.35)
  Top 0.152: v49.68,85.11 49.23,84.66 49.23,83.82 R10.2
  Bottom 0.152: U$4.6 27.96,95.25 29.18,96.47 30.94,96.47 31.7,95.71 31.7,94.87 32.54,94.03 38.48,94.03 39.32,93.19 39.32,92.35 46.56,85.11 v49.68,85.11 55.17,79.63 67.13,79.63 75.59,71.17 76.2,71.17 V2.3
MK2  (via drill 0.35)
  Top 0.152: U$4.10 33.45,95.25 34.67,94.03 35.97,94.03 36.73,93.27 36.73,92.35 37.57,91.52 38.63,91.52 39.32,92.2 39.32,93.12 40.08,93.88 41.15,93.88 41.83,93.19 41.83,92.35 42.98,91.21 42.98,80.01 46.56,76.43 48.01,76.43 49,77.42 49.15,77.42 R11.2 49.23,77.42 51.51,77.42 63.25,65.68 v65.99,65.68
  Bottom 0.152: v65.99,65.68 72.69,65.68 78.11,71.09 78.72,71.09 V2.2
MK3  (via drill 0.35)
  Top 0.152: U$4.14 39.62,96.77 49.45,96.77 55.55,90.68 R12.2 55.63,83.82 56.16,83.29 v56.77,83.29 | v71.4,81 V2.1
  Bottom 0.152: v71.4,81 59.05,81 v56.77,83.29
MK4  (via drill 0.35)
  Top 0.152: V2.15 75.97,60.73 71.93,60.73 70.18,62.48 70.18,63.86 68.96,65.08 67.59,65.08 55.63,77.04 55.63,77.42 R13.2 55.55,77.5 55.47,77.57 v55.47,80.24
  Bottom 0.152: v55.47,80.24 44.5,91.21 44.5,93.12 43.2,94.41 43.2,95.25 U$4.18
MOSI
  Top 0.152: U3.17 69.88,54.63 70.48,54.63 75.67,59.82 76.96,59.82 78.49,61.34 90.83,61.34 92.66,59.51 94.18,59.51 95.25,58.45 ISP1.4
  Bottom 0.152: 79.82,17.18 81.38,18.75 82.3,18.75 83.82,20.27 U$1.5 | 79.82,17.18 76.43,13.79 72.69,13.79 71.09,15.39 62.79,15.39 61.19,13.79 57.45,13.79 53.65,17.6 37.57,17.6 34.9,20.27 34.29,20.27 U$2.5 | 79.82,17.18 77.8,19.2 77.8,20.65 71.32,27.13 71.32,47.47 69.88,48.92 69.88,54.56 U3.17
N$3
  Top 0.152: IC1.7 IC1.6 22.86,43.2 20.95,43.2 15.77,48.39 TRIG2.TIP
N$4
  Top 0.152: IC1.8 IC1.9 30.48,43.2 24.77,43.2 23.16,44.81 21.79,44.81 17.6,49 17.6,61.8 15.77,63.63 TRIG1.TIP
N$5
  Top 0.152: IC1.14 IC1.13
  Bottom 0.152: IC1.13 24.84,53.34 23.24,51.74 21.87,51.74 17.91,47.78 17.91,18.9 15.77,16.76 TRIG4.TIP
N$6
  Top 0.152: IC1.1 IC1.2
  Bottom 0.152: IC1.2 22.86,53.19 17.6,47.93 17.6,33.83 15.77,32 TRIG3.TIP
N$7
  Top 0.152: IC5.9 62.26,27.96 64.77,27.96 IC5.8
  Bottom 0.152: IC5.9 62.18,27.89 62.18,27.28 55.55,20.65 55.55,19.28 55.02,18.75 54.25,18.75 52.96,20.04 52.96,21.41 52.5,21.87 31.32,21.87 30.1,20.65 30.1,19.28 26.52,15.7 CV1.TIP
N$8
  Top 0.152: R2.2 76.5,83.82 76.5,89.53 76.43,89.61 76.43,92.13 77.42,93.12 77.42,95.4 BUT2.K
N$10
  Top 0.152: 67.06,39.4 73.91,39.4 C17.1 | 67.06,39.4 62.26,44.2 62.26,46.94 U3.9 | 67.06,39.4 Q2.2
N$11
  Top 0.152: Q2.1 56.35,40.42 | 56.35,40.42 56.31,40.46 48.54,40.46 47.47,39.4 47.32,39.4 C18.1 | 56.35,40.42 60.73,44.81 60.73,47.02 61.8,48.08 62.64,48.08 63.7,47.02 64.77,47.02 U3.10
N$17
  Top 0.152: 94.34,36.04 94.34,31.77 R6.1 | 94.34,36.04 94.34,36.96 T1.B | 94.34,36.04 96.77,36.04 97,36.27 97,41.83 96.24,42.6 96.24,44.42 R7.2
N$25
  Top 0.152: IC5.6 62.26,20.34 64.77,20.34 IC5.7
  Bottom 0.152: IC5.7 64.77,20.27 68.96,20.27 73.46,15.77 CV4.TIP
N$26
  Top 0.152: R6.2 96.16,31.7 96.16,23.16 88.77,15.77 CLK_IN.TIP
N$31
  Top 0.152: IC5.1 49.53,20.34 52.05,20.34 IC5.2
  Bottom 0.152: IC5.2 52.12,20.27 52.27,20.27 56.77,15.77 58.22,15.77 CV3.TIP
N$36
  Top 0.152: IC5.13 52.05,27.96 49.53,27.96 IC5.14 49.53,23.55 41.76,15.77 CV2.TIP
N$65
  Top 0.152: R56.2 61.34,83.82 61.34,88.92 61.95,89.53 61.95,94.41 BUT1.K
POT1
  Top 0.152: GLIDE1.P$2 91.44,79.32 80.39,68.28 80.39,63.17 79.17,61.95 78.18,61.95 76.66,60.43 66.52,60.43 61.19,55.09 61.19,54.63 60.12,53.57 56.69,53.57 55.7,54.56 54.63,54.56 U3.23
RST
  Top 0.152: U3.1 41.91,47.02 42.98,47.02 45.8,49.84 50.44,49.84 52.81,52.2 89,52.2 92.66,55.85 ISP1.5
SCK
  Top 0.152: U3.19 64.77,54.56 65.84,54.56 66.83,53.57 70.33,53.57 71.32,54.56 71.32,55.02 75.82,59.51 77.11,59.51 78.64,61.04 90.07,61.04 92.66,58.45 ISP1.3 | U$1.4 79.4,18.44 49.38,18.44 44.73,13.79 38.86,13.79 32.38,20.27 31.77,20.27 U$2.4
  Bottom 0.152: U$1.4 87.25,26.29 87.25,51.89 92.66,57.3 92.66,58.37 ISP1.3
T0  (via drill 0.35)
  Top 0.152: U$4.1 22.86,92.66 28.88,86.64 R18.2 28.96,83.82 29.26,83.52 v29.26,82.53
  Bottom 0.152: v29.26,82.53 40.62,71.17 V1.15
T1
  Top 0.152: V1.14 41.6,72.69 36.35,72.69 31.62,77.42 28.96,77.42 R17.2
  Bottom 0.152: V1.14 25.45,88.85 25.45,92.66 U$4.3
T2
  Top 0.152: R16.2 35.2,83.82 35.2,85.42 27.96,92.66 U$4.5
  Bottom 0.152: V1.13 45.72,74.91 27.96,92.66 U$4.5
T3
  Top 0.152: U$4.7 30.48,92.66 31.62,91.52 33.83,91.52 41.53,83.82 R15.2 41.6,83.82 42.22,83.21 42.22,79.02 48.23,73 48.23,71.17 V1.12
T4  (via drill 0.35)
  Top 0.152: v22.55,79.7 22.55,77.5 R19.2
  Bottom 0.152: v22.55,79.7 22.55,90.68 24.23,92.35 24.23,93.27 24.84,93.88 31.85,93.88 U$4.9 50.75,74.98 50.75,71.17 V1.11
T5
  Top 0.152: R20.2 22.48,83.82 22.48,91.36 21.64,92.2 21.64,93.19 22.33,93.88 34.37,93.88 35.51,92.73 U$4.11
  Bottom 0.152: V1.10 53.34,74.91 35.59,92.66 U$4.11
T6
  Top 0.152: R21.2 52.96,91.44 47.93,96.47 40.16,96.47 39.32,95.63 39.32,93.95 38.1,92.73 U$4.13
  Bottom 0.152: V1.9 55.85,71.17 55.85,74.91 38.1,92.66 U$4.13
T7
  Top 0.152: 47.05,67.86 49.84,65.08 51.82,65.08 53.34,63.55 V1.7 | 47.05,67.86 44.81,70.1 44.81,71.48 43.28,73 41,73 36.58,77.42 35.28,77.42 R22.2 | 47.05,67.86 49.15,69.95 49.15,72.54 42.67,79.02 42.67,84.51 40.69,86.49 40.69,92.66 U$4.15
TRIG1
  Top 0.152: IC1.10 33.07,45.72 41.91,54.56 U3.28
TRIG2
  Top 0.152: IC1.5 28.5,45.72 29.41,44.81 42.29,44.81 44.42,46.94 U3.2
TRIG3
  Bottom 0.152: IC1.3 22.86,50.75 28.57,50.75 30.18,49.15 44.81,49.15 46.94,47.02 U3.3
TRIG4
  Bottom 0.152: U3.5 48.31,50.75 30.48,50.75 IC1.12
VOUTA
  Top 0.152: U$1.14 72.08,26.36 61.87,26.36 60.35,27.89 59.74,27.89 IC5.10
VOUTB
  Top 0.152: IC5.12 54.63,27.89 55.24,27.89 57.07,26.06 81.99,26.06 83.82,27.89 U$1.10
VOUTC
  Bottom 0.152: IC5.3 54.56,20.34 49.53,25.38 26.67,25.38 24.16,27.89 U$2.14
VOUTD
  Top 0.152: IC5.5 59.66,20.27 59.05,20.27 57.53,18.75 56.77,18.75 55.55,19.96 55.55,25.07 52.96,27.66 52.96,29.03 52.5,29.49 35.81,29.49 34.29,27.96 U$2.10

### Text on the board
bNames: Pure Keys / Dev Board / PCB 3 / GMSN! and / Andy C | KeyBoard / Controller